# EAGLE design midimixer-channel (EAGLE 7.3.0)

## Sheet 1 of 2
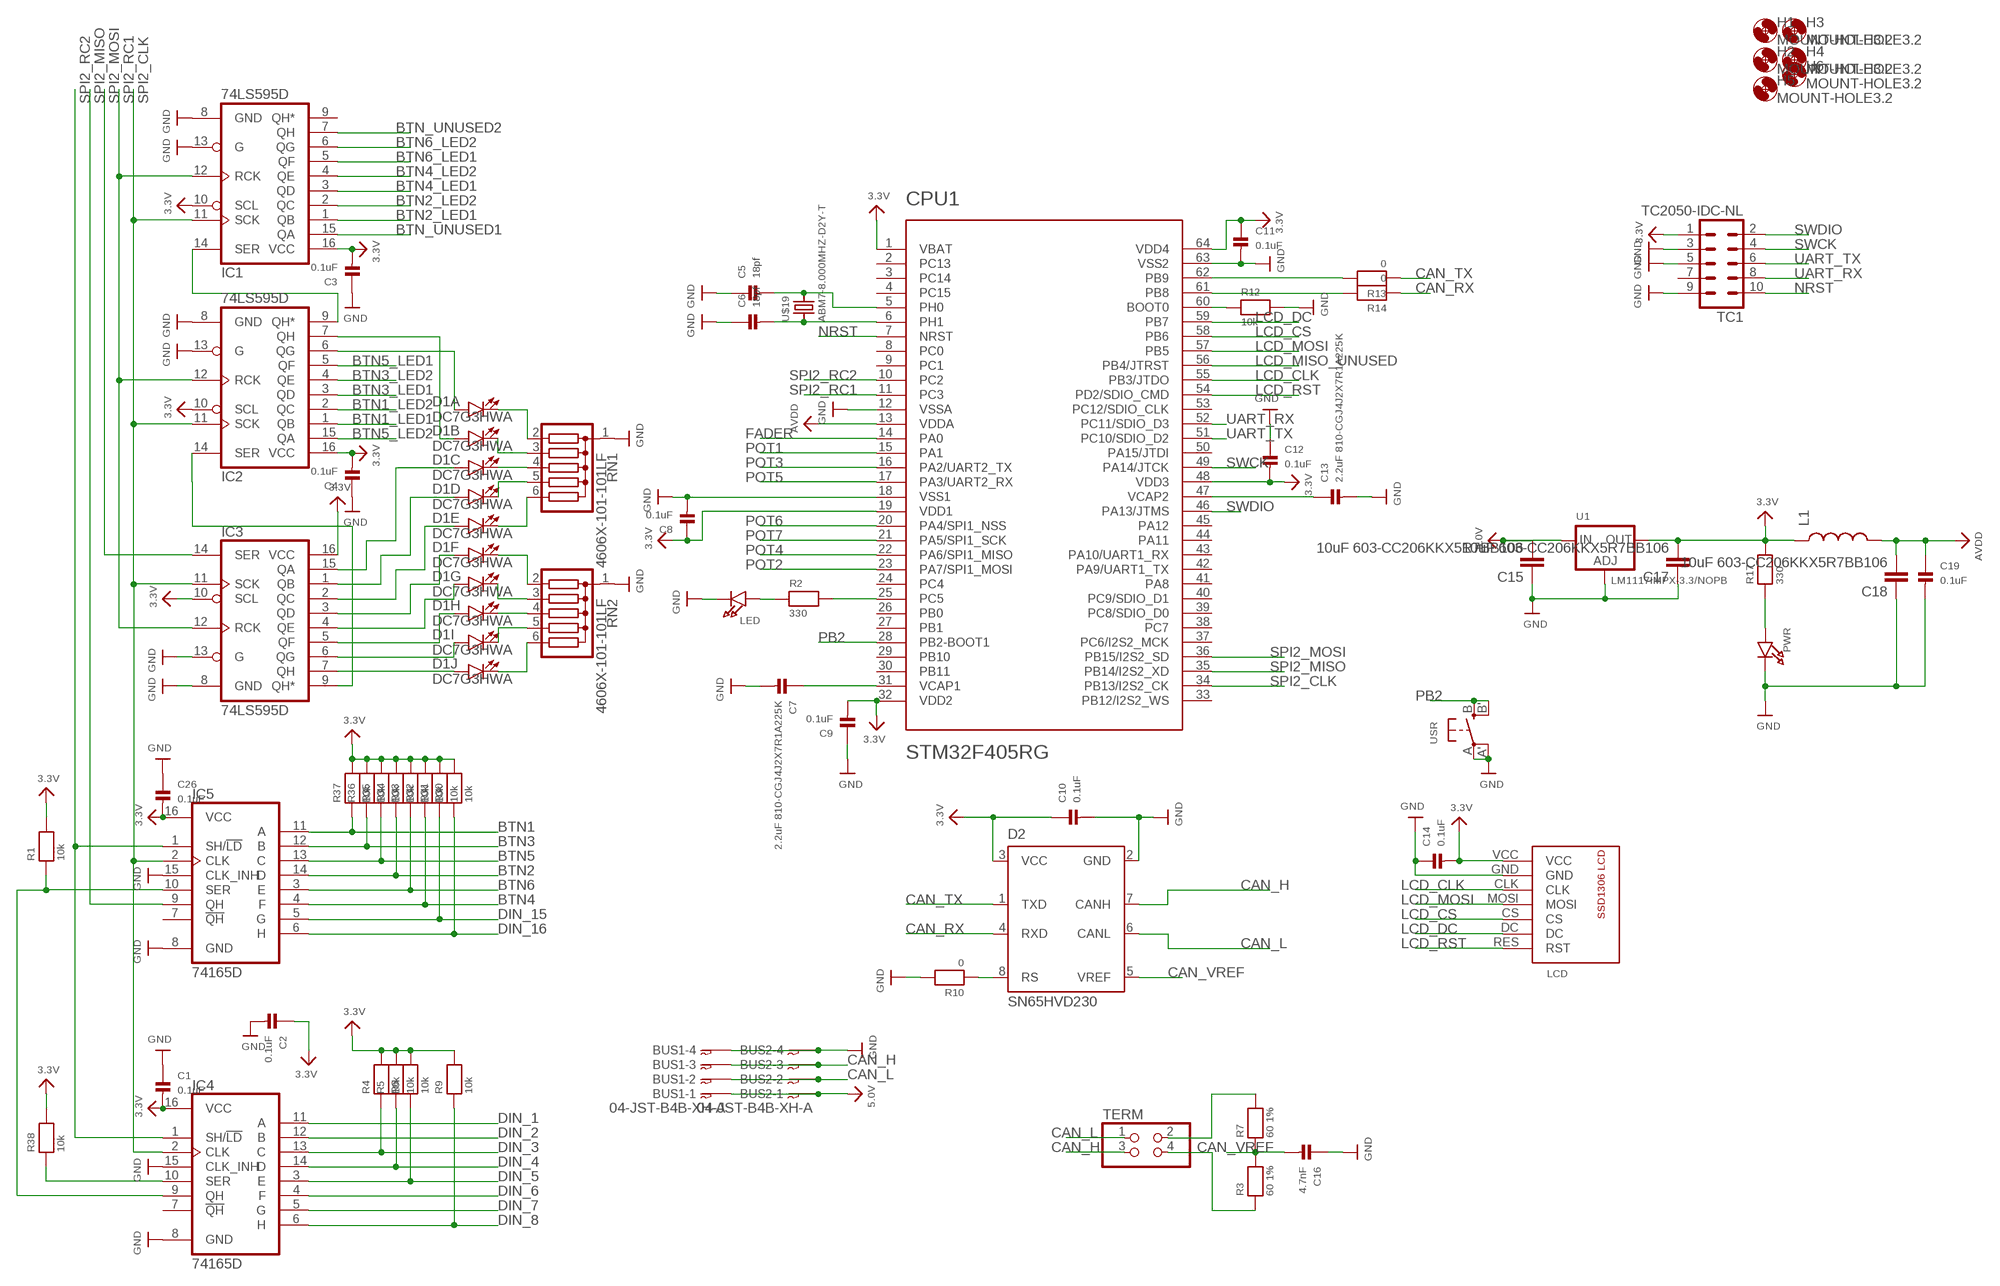
[diagram p0: schematic, sheet 1]

### Parts
BUS1  04-JST-B4B-XH-A  [B4B-XH]
BUS2  04-JST-B4B-XH-A  [B4B-XH]
C1  0.1uF  CAP_CERAMIC0603  [0603]
C2  0.1uF  CAP_CERAMIC0603  [0603]
C3  0.1uF  CAP_CERAMIC0603  [0603]
C4  0.1uF  CAP_CERAMIC0603  [0603]
C5  18pf  CAP_CERAMIC0603  [0603]
C6  18pf  CAP_CERAMIC0603  [0603]
C7  2.2uF 810-CGJ4J2X7R1A225K  CAP_CERAMIC0805  [0805]
C8  0.1uF  CAP_CERAMIC0603  [0603]
C9  0.1uF  CAP_CERAMIC0603  [0603]
C10  0.1uF  CAP_CERAMIC0603  [0603]
C11  0.1uF  CAP_CERAMIC0603  [0603]
C12  0.1uF  CAP_CERAMIC0603  [0603]
C13  2.2uF 810-CGJ4J2X7R1A225K  CAP_CERAMIC0805  [0805]
C14  0.1uF  CAP_CERAMIC0603  [0603]
C15  10uF 603-CC206KKX5R7BB106  CAP1206  [1206]
C16  4.7nF  CAP_CERAMIC0603  [0603]
C17  10uF 603-CC206KKX5R7BB106  CAP1206  [1206]
C18  10uF 603-CC206KKX5R7BB106  CAP1206  [1206]
C19  0.1uF  CAP_CERAMIC0603  [0603]
C26  0.1uF  CAP_CERAMIC0603  [0603]
CPU1  STM32F405RG  [TQFP64]
D1  DC7G3HWA  LED_BARGRAPH_10  [LED_BARGAPH_10]
D2  SN65HVD230  [SO8]
H1  MOUNT-HOLE3.2  [3,2]
H2  MOUNT-HOLE3.2  [3,2]
H3  MOUNT-HOLE3.2  [3,2]
H4  MOUNT-HOLE3.2  [3,2]
H5  MOUNT-HOLE3.2  [3,2]
H6  MOUNT-HOLE3.2  [3,2]
IC1  74LS595D  [SO16]
IC2  74LS595D  [SO16]
IC3  74LS595D  [SO16]
IC4  74165D  [SO16]
IC5  74165D  [SO16]
L1  INDUCTOR0805  [0805]
LCD  SSD1306-7PINWITHOUT-HOLES  [SSD1306-7PIN-NO-HOLES]
LED  LED0603  [CHIPLED_0603]
PWR  LED0603  [CHIPLED_0603]
R1  10k  RESISTOR_0603  [_0603]
R2  330  RESISTOR0603  [0603]
R3  60 1%  RESISTOR0603  [0603]
R4  10k  RESISTOR_0603  [_0603]
R5  10k  RESISTOR_0603  [_0603]
R6  10k  RESISTOR_0603  [_0603]
R7  60 1%  RESISTOR0603  [0603]
R9  10k  RESISTOR_0603  [_0603]
R10  0  RESISTOR_0603  [_0603]
R12  10k  RESISTOR_0603  [_0603]
R13  0  RESISTOR_0603  [_0603]
R14  0  RESISTOR_0603  [_0603]
R17  330  RESISTOR0603  [0603]
R30  10k  RESISTOR_0603  [_0603]
R31  10k  RESISTOR_0603  [_0603]
R32  10k  RESISTOR_0603  [_0603]
R33  10k  RESISTOR_0603  [_0603]
R34  10k  RESISTOR_0603  [_0603]
R35  10k  RESISTOR_0603  [_0603]
R36  10k  RESISTOR_0603  [_0603]
R37  10k  RESISTOR_0603  [_0603]
R38  10k  RESISTOR_0603  [_0603]
RN1  4606X-101-101LF  G05R  [SIL6]
RN2  4606X-101-101LF  G05R  [SIL6]
TC1  TC2050-IDC-NL  [TC2050-IDC-NL]
TERM  PINHD-2X2  [2X02]
U1  LM1117IMPX-3.3/NOPB  LM1117SOT223-REFLOW  [SOT223-R]
U$19  ABM7-8.000MHZ-D2Y-T  [ABM7-8.000MHZ-D2Y-T]
USR  SWITCH_TACT_SMT  [EVQ-Q2]

### Nets
3.3V: C1.2 C2.1 C3.2 C4.2 C8.1 C9.2 C10.1 C11.1 C12.2 C14.2 C17.2 C26.2 CPU1.1(VBAT) CPU1.19(VDD1) CPU1.32(VDD2) CPU1.48(VDD3) CPU1.64(VDD4) D2.3(VCC) IC1.10(SCL) IC1.16(VCC) IC2.10(SCL) IC2.16(VCC) IC3.10(SCL) IC3.16(VCC) IC4.16(VCC) IC5.16(VCC) L1.1 LCD.VCC R1.2 R4.2 R5.2 R6.2 R9.2 R17.2 R30.2 R31.2 R32.2 R33.2 R34.2 R35.2 R36.2 R37.2 R38.2 TC1.1 U1.2(OUT) ; also sheet 2
5.0V: BUS1.P$1 BUS2.P$1 C15.2 U1.3(IN)
AVDD: C18.2 C19.1 CPU1.13(VDDA) L1.2
BTN1: IC5.11(A) R37.1 ; also sheet 2
BTN1_LED1: IC2.1(QB) ; also sheet 2
BTN1_LED2: IC2.2(QC) ; also sheet 2
BTN2: IC5.14(D) R34.1 ; also sheet 2
BTN2_LED1: IC1.1(QB) ; also sheet 2
BTN2_LED2: IC1.2(QC) ; also sheet 2
BTN3: IC5.12(B) R36.1 ; also sheet 2
BTN3_LED1: IC2.3(QD) ; also sheet 2
BTN3_LED2: IC2.4(QE) ; also sheet 2
BTN4: IC5.4(F) R32.1 ; also sheet 2
BTN4_LED1: IC1.3(QD) ; also sheet 2
BTN4_LED2: IC1.4(QE) ; also sheet 2
BTN5: IC5.13(C) R35.1 ; also sheet 2
BTN5_LED1: IC2.5(QF) ; also sheet 2
BTN5_LED2: IC2.15(QA) ; also sheet 2
BTN6: IC5.3(E) R33.1 ; also sheet 2
BTN6_LED1: IC1.5(QF) ; also sheet 2
BTN6_LED2: IC1.6(QG) ; also sheet 2
BTN_UNUSED1: IC1.15(QA)
BTN_UNUSED2: IC1.7(QH)
CAN_H: BUS1.P$3 BUS2.P$3 D2.7(CANH) TERM.3
CAN_L: BUS1.P$2 BUS2.P$2 D2.6(CANL) TERM.1
CAN_RX: D2.4(RXD) R14.1
CAN_TX: D2.1(TXD) R13.1
CAN_VREF: C16.2 D2.5(VREF) R3.2 R7.1
DIN_1: IC4.11(A) ; also sheet 2
DIN_2: IC4.12(B) ; also sheet 2
DIN_3: IC4.13(C) R4.1 ; also sheet 2
DIN_4: IC4.14(D) R5.1
DIN_5: IC4.3(E) R6.1 ; also sheet 2
DIN_6: IC4.4(F) ; also sheet 2
DIN_7: IC4.5(G) ; also sheet 2
DIN_8: IC4.6(H) R9.1
DIN_15: IC5.5(G) R31.1
DIN_16: IC5.6(H) R30.1
FADER: CPU1.14(PA0) ; also sheet 2
GND: BUS1.P$4 BUS2.P$4 C1.1 C2.2 C3.1 C4.1 C5.1 C6.1 C7.2 C8.2 C9.1 C10.2 C11.2 C12.1 C13.2 C14.1 C15.1 C16.1 C17.1 C18.1 C19.2 C26.1 CPU1.12(VSSA) CPU1.18(VSS1) CPU1.63(VSS2) D2.2(GND) IC1.8(GND) IC1.13(G) IC2.8(GND) IC2.13(G) IC3.8(GND) IC3.13(G) IC4.8(GND) IC4.15(CLK_INH) IC5.8(GND) IC5.15(CLK_INH) LCD.GND LED.C PWR.C R10.2 R12.2 RN1.1 RN2.1 TC1.3 TC1.5 TC1.9 U1.1(ADJ) USR.A'(P1) USR.A(P) ; also sheet 2
LCD_CLK: CPU1.55(PB3/JTDO) LCD.CLK
LCD_CS: CPU1.58(PB6) LCD.CS
LCD_DC: CPU1.59(PB7) LCD.DC
LCD_MISO_UNUSED: CPU1.56(PB4/JTRST)
LCD_MOSI: CPU1.57(PB5) LCD.MOSI
LCD_RST: CPU1.54(PD2/SDIO_CMD) LCD.RES(RST)
N$1: C6.2 CPU1.6(PH1) U$19.P$1
N$2: C5.2 CPU1.5(PH0) U$19.P$2
N$3: C13.1 CPU1.47(VCAP2)
N$4: C7.1 CPU1.31(VCAP1)
N$5: PWR.A R17.1
N$6: CPU1.60(BOOT0) R12.1
N$7: D1.5(E:A) IC3.2(QC)
N$8: D1.2(B:A) IC2.7(QH)
N$11: D1.1(A:A) IC2.6(QG)
N$12: IC1.14(SER) IC2.9(QH*)
N$13: CPU1.62(PB9) R13.2
N$14: D1.20(A:C) RN1.2
N$15: D1.19(B:C) RN1.3
N$16: D1.18(C:C) RN1.4
N$17: D1.17(D:C) RN1.5
N$18: D1.16(E:C) RN1.6
N$19: D1.15(F:C) RN2.2
N$20: D1.14(G:C) RN2.3
N$21: D1.13(H:C) RN2.4
N$22: D1.12(I:C) RN2.5
N$23: D1.11(J:C) RN2.6
N$26: IC4.10(SER) R38.1
N$27: CPU1.61(PB8) R14.2
N$28: IC4.9(QH) IC5.10(SER) R1.1
N$31: LED.A R2.1
N$38: D1.10(J:A) IC3.7(QH)
N$41: D1.9(I:A) IC3.6(QG)
N$42: D1.8(H:A) IC3.5(QF)
N$43: CPU1.25(PC5) R2.2
N$46: R7.2 TERM.2
N$47: R3.1 TERM.4
N$52: D1.7(G:A) IC3.4(QE)
N$53: D1.6(F:A) IC3.3(QD)
N$55: D1.4(D:A) IC3.1(QB)
N$56: D1.3(C:A) IC3.15(QA)
N$57: IC2.14(SER) IC3.9(QH*)
N$73: D2.8(RS) R10.1
NRST: CPU1.7(NRST) TC1.10
PB2: CPU1.28(PB2-BOOT1) USR.B'(S1) USR.B(S)
POT1: CPU1.15(PA1) ; also sheet 2
POT2: CPU1.23(PA7/SPI1_MOSI) ; also sheet 2
POT3: CPU1.16(PA2/UART2_TX) ; also sheet 2
POT4: CPU1.22(PA6/SPI1_MISO) ; also sheet 2
POT5: CPU1.17(PA3/UART2_RX) ; also sheet 2
POT6: CPU1.20(PA4/SPI1_NSS) ; also sheet 2
POT7: CPU1.21(PA5/SPI1_SCK) ; also sheet 2
SPI2_CLK: CPU1.34(PB13/I2S2_CK) IC1.11(SCK) IC2.11(SCK) IC3.11(SCK) IC4.2(CLK) IC5.2(CLK)
SPI2_MISO: CPU1.35(PB14/I2S2_XD) IC5.9(QH)
SPI2_MOSI: CPU1.36(PB15/I2S2_SD) IC3.14(SER)
SPI2_RC1: CPU1.11(PC3) IC1.12(RCK) IC2.12(RCK) IC3.12(RCK)
SPI2_RC2: CPU1.10(PC2) IC4.1(SH/!LD) IC5.1(SH/!LD)
SWCK: CPU1.49(PA14/JTCK) TC1.4
SWDIO: CPU1.46(PA13/JTMS) TC1.2
UART_RX: CPU1.52(PC11/SDIO_D3) TC1.8
UART_TX: CPU1.51(PC10/SDIO_D2) TC1.6
Unconnected: CPU1.2(PC13) CPU1.3(PC14) CPU1.4(PC15) CPU1.8(PC0) CPU1.9(PC1) CPU1.24(PC4) CPU1.26(PB0) CPU1.27(PB1) CPU1.29(PB10) CPU1.30(PB11) CPU1.33(PB12/I2S2_WS) CPU1.37(PC6/I2S2_MCK) CPU1.38(PC7) CPU1.39(PC8/SDIO_D0) CPU1.40(PC9/SDIO_D1) CPU1.41(PA8) CPU1.42(PA9/UART1_TX) CPU1.43(PA10/UART1_RX) CPU1.44(PA11) CPU1.45(PA12) CPU1.50(PA15/JTDI) CPU1.53(PC12/SDIO_CLK) IC1.9(QH*) IC4.7(!QH) IC5.7(!QH) TC1.7

## Sheet 2 of 2
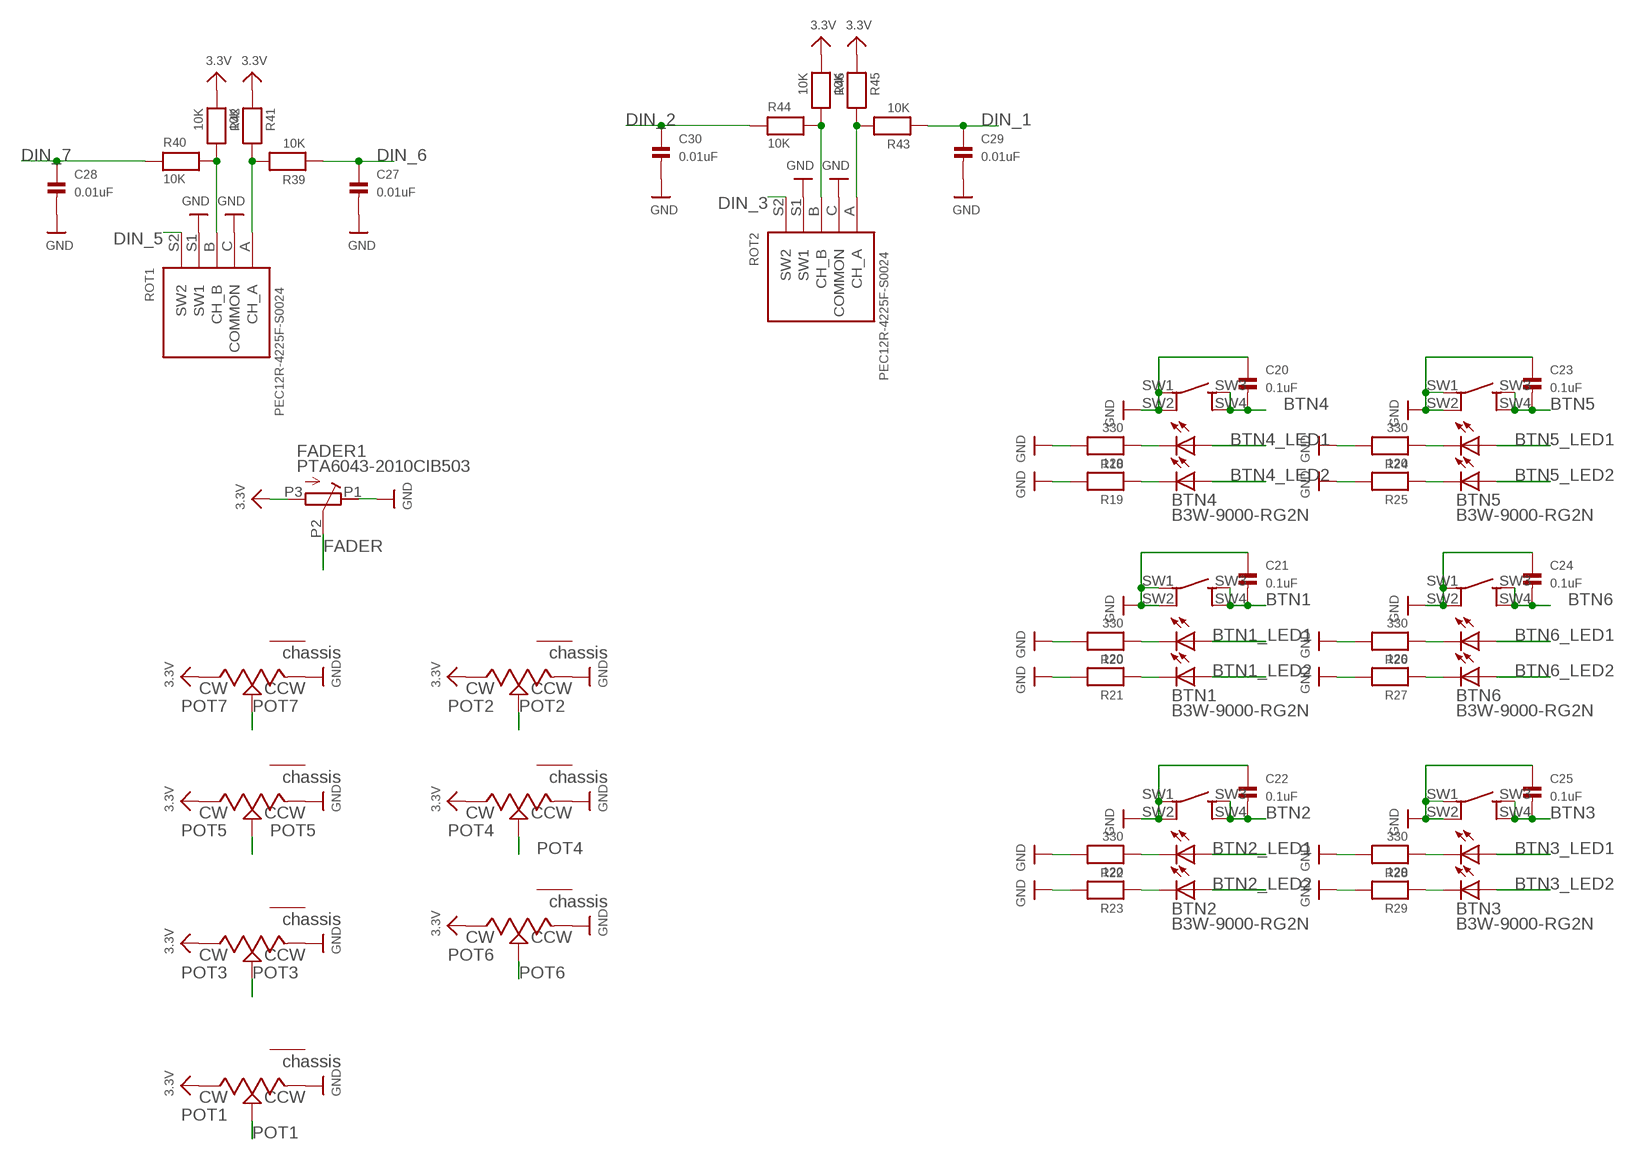
[diagram p1: schematic, sheet 2]

### Parts
BTN1  B3W-9000-RG2N  [B3W-9000-X2X]
BTN2  B3W-9000-RG2N  [B3W-9000-X2X]
BTN3  B3W-9000-RG2N  [B3W-9000-X2X]
BTN4  B3W-9000-RG2N  [B3W-9000-X2X]
BTN5  B3W-9000-RG2N  [B3W-9000-X2X]
BTN6  B3W-9000-RG2N  [B3W-9000-X2X]
C20  0.1uF  CAP_CERAMIC0603  [0603]
C21  0.1uF  CAP_CERAMIC0603  [0603]
C22  0.1uF  CAP_CERAMIC0603  [0603]
C23  0.1uF  CAP_CERAMIC0603  [0603]
C24  0.1uF  CAP_CERAMIC0603  [0603]
C25  0.1uF  CAP_CERAMIC0603  [0603]
C27  0.01uF  CAP_CERAMIC0603  [0603]
C28  0.01uF  CAP_CERAMIC0603  [0603]
C29  0.01uF  CAP_CERAMIC0603  [0603]
C30  0.01uF  CAP_CERAMIC0603  [0603]
FADER1  PTA6043-2010CIB503  PTA6043-2015CPB103  [PTA6043-2015CPB103]
POT1  POTENTIOMETERPTV09A_VERTICAL  [PTV09A-4]
POT2  POTENTIOMETERPTV09A_VERTICAL  [PTV09A-4]
POT3  POTENTIOMETERPTV09A_VERTICAL  [PTV09A-4]
POT4  POTENTIOMETERPTV09A_VERTICAL  [PTV09A-4]
POT5  POTENTIOMETERPTV09A_VERTICAL  [PTV09A-4]
POT6  POTENTIOMETERPTV09A_VERTICAL  [PTV09A-4]
POT7  POTENTIOMETERPTV09A_VERTICAL  [PTV09A-4]
R18  330  RESISTOR0603  [0603]
R19  120  RESISTOR0603  [0603]
R20  330  RESISTOR0603  [0603]
R21  120  RESISTOR0603  [0603]
R22  330  RESISTOR0603  [0603]
R23  120  RESISTOR0603  [0603]
R24  330  RESISTOR0603  [0603]
R25  120  RESISTOR0603  [0603]
R26  330  RESISTOR0603  [0603]
R27  120  RESISTOR0603  [0603]
R28  330  RESISTOR0603  [0603]
R29  120  RESISTOR0603  [0603]
R39  10K  RESISTOR0603  [0603]
R40  10K  RESISTOR0603  [0603]
R41  10K  RESISTOR0603  [0603]
R42  10K  RESISTOR0603  [0603]
R43  10K  RESISTOR0603  [0603]
R44  10K  RESISTOR0603  [0603]
R45  10K  RESISTOR0603  [0603]
R46  10K  RESISTOR0603  [0603]
ROT1  PEC12R-4225F-S0024  PEC11-4215K-S0024  [PEC111-4XXXK-SXXXX]
ROT2  PEC12R-4225F-S0024  PEC11-4215K-S0024  [PEC111-4XXXK-SXXXX]

### Nets
3.3V: FADER1.P3(E) POT1.CW POT2.CW POT3.CW POT4.CW POT5.CW POT6.CW POT7.CW R41.1 R42.1 R45.1 R46.1 ; also sheet 1
BTN1: BTN1.SW3(SW2_A) BTN1.SW4(SW2_B) C21.2 ; also sheet 1
BTN1_LED1: BTN1.LED1+ ; also sheet 1
BTN1_LED2: BTN1.LED2+ ; also sheet 1
BTN2: BTN2.SW3(SW2_A) BTN2.SW4(SW2_B) C22.2 ; also sheet 1
BTN2_LED1: BTN2.LED1+ ; also sheet 1
BTN2_LED2: BTN2.LED2+ ; also sheet 1
BTN3: BTN3.SW3(SW2_A) BTN3.SW4(SW2_B) C25.2 ; also sheet 1
BTN3_LED1: BTN3.LED1+ ; also sheet 1
BTN3_LED2: BTN3.LED2+ ; also sheet 1
BTN4: BTN4.SW3(SW2_A) BTN4.SW4(SW2_B) C20.2 ; also sheet 1
BTN4_LED1: BTN4.LED1+ ; also sheet 1
BTN4_LED2: BTN4.LED2+ ; also sheet 1
BTN5: BTN5.SW3(SW2_A) BTN5.SW4(SW2_B) C23.2 ; also sheet 1
BTN5_LED1: BTN5.LED1+ ; also sheet 1
BTN5_LED2: BTN5.LED2+ ; also sheet 1
BTN6: BTN6.SW3(SW2_A) BTN6.SW4(SW2_B) C24.2 ; also sheet 1
BTN6_LED1: BTN6.LED1+ ; also sheet 1
BTN6_LED2: BTN6.LED2+ ; also sheet 1
DIN_1: C29.1 R43.1 ; also sheet 1
DIN_2: C30.1 R44.1 ; also sheet 1
DIN_3: ROT2.S2(SW2) ; also sheet 1
DIN_5: ROT1.S2(SW2) ; also sheet 1
DIN_6: C27.1 R39.1 ; also sheet 1
DIN_7: C28.1 R40.1 ; also sheet 1
FADER: FADER1.P2(S) ; also sheet 1
GND: BTN1.SW1(SW1_A) BTN1.SW2(SW1_B) BTN2.SW1(SW1_A) BTN2.SW2(SW1_B) BTN3.SW1(SW1_A) BTN3.SW2(SW1_B) BTN4.SW1(SW1_A) BTN4.SW2(SW1_B) BTN5.SW1(SW1_A) BTN5.SW2(SW1_B) BTN6.SW1(SW1_A) BTN6.SW2(SW1_B) C20.1 C21.1 C22.1 C23.1 C24.1 C25.1 C27.2 C28.2 C29.2 C30.2 FADER1.P1(A) POT1.CCW POT2.CCW POT3.CCW POT4.CCW POT5.CCW POT6.CCW POT7.CCW R18.2 R19.2 R20.2 R21.2 R22.2 R23.2 R24.2 R25.2 R26.2 R27.2 R28.2 R29.2 ROT1.C(COMMON) ROT1.S1(SW1) ROT2.C(COMMON) ROT2.S1(SW1) ; also sheet 1
N$9: BTN4.LED1- R18.1
N$10: BTN4.LED2- R19.1
N$24: BTN1.LED1- R20.1
N$25: BTN1.LED2- R21.1
N$29: BTN5.LED1- R24.1
N$30: BTN5.LED2- R25.1
N$32: R40.2 R42.2 ROT1.B(CH_B)
N$33: R39.2 R41.2 ROT1.A(CH_A)
N$34: BTN6.LED1- R26.1
N$35: BTN6.LED2- R27.1
N$36: R44.2 R46.2 ROT2.B(CH_B)
N$37: R43.2 R45.2 ROT2.A(CH_A)
N$39: BTN2.LED1- R22.1
N$40: BTN2.LED2- R23.1
N$44: BTN3.LED1- R28.1
N$45: BTN3.LED2- R29.1
POT1: POT1.CENTER(WIPER) ; also sheet 1
POT2: POT2.CENTER(WIPER) ; also sheet 1
POT3: POT3.CENTER(WIPER) ; also sheet 1
POT4: POT4.CENTER(WIPER) ; also sheet 1
POT5: POT5.CENTER(WIPER) ; also sheet 1
POT6: POT6.CENTER(WIPER) ; also sheet 1
POT7: POT7.CENTER(WIPER) ; also sheet 1
Unconnected: POT1.4(CHASSIS) POT2.4(CHASSIS) POT3.4(CHASSIS) POT4.4(CHASSIS) POT5.4(CHASSIS) POT6.4(CHASSIS) POT7.4(CHASSIS)

## Library data of the parts
BTN1-BTN6 = keves:B3W-9000-RG2N
BUS1 BUS2 = bt_con-jst-xh:04-JST: JST CONNECTOR
C1-C14 C16 C19-C30 = microbuilder:CAP_CERAMIC: Ceramic Capacitors 0402 - 0402 Surface Mount Capacitors 16pF 50V 5% [Digikey: 445-4899-2-ND] 18pF 50V 5% [Digikey: 490-1281-2-ND] 22pF 50V 5% [Digikey: 490-1283-2-ND] 68pF 50V 5% [Digikey: 490-1289-2-ND] 0.1uF 10V 10% [Digikey: 490-1318-2-ND] 1.0uF 6.3V 10% [Digikey: 490-1320-2-ND] 0603 - 0603 Surface Mount Capacitors 16 pF 50V 5% [Digikey: 445-5051-2-ND] 22 pF 50V [Digikey: PCC220ACVTR-ND] 33 pF 50V 5% [Digikey: 490-1415-1-ND] 56pF 50V 5% [Digikey: 490-1421-1-ND] 220pF 50V 5% [Digikey: 445-1285-1-ND] 680 pF 50V 2200 pF 50V 5% C0G [Digikey: 445-1297-1-ND] 5600 pF 100V 5% X7R [Digikey: 478-3711-1-ND] 0.1 µF 25V 10% [Digikey: PCC2277TR-ND] 0.22 µF 16V 10% X7R [Digikey: 445-1318-1-ND] 1.0 µF 25V 10% [Digikey: 445-5146-2-ND] 0603 - RF Specific 3pF 250V +/-0.1pF RF [Digikey: 712-1347-1-ND] 18 pF 250V 5% [Digikey: 478-3505-1-ND or 712-1322-1-ND] 56 pF 250V 5% C0G RF [Digikey: 490-4867-1-ND] 68 pF 250V RF [Digikey: 490-4868-1-ND] 0805 - 0805 Surface Mount Capacitors 220 pF 250V 2% RF Ceramic Capacitor [Digikey: 712-1398-1-ND] 1000 pF 50V 2% NP0 Ceramic Capacitor [Digikey: 478-3760-1-ND] 0.1 µF 25V 10% Ceramic Capacitor [Digikey: PCC1828TR-ND] 1.0 µF 16V 10% Ceramic Capacitor[Digikey: 490-1691-2-ND] 10.0 µF 10V 10% Ceramic Capacitor[Digikey: 709-1228-1-ND] 10.0 uF 16V 10% Ceramic Capacitor [Digikey: 478-5165-2-ND] 47 uF 6.3V 20% Ceramic Capacitor [Digikey: 587-1779-1-ND or 399-5506-1-ND] 1206 - 1206 Surface Mount Capacitors 47uF 10V 20% Ceramic Capacitor [Digikey: 490-5528-1-ND or 399-5508-1-ND or 445-6010-1-ND] 100uF 6.3V -20%, +80% Y5V Ceramic Capacitor (Digikey: 490-4512-1-ND, Mouser: 81-GRM31CF50J107ZE1L)
C15 C17 C18 = SparkFun-Passives:CAP: Capacitor Standard 0603 ceramic capacitor, and 0.1" leaded capacitor.
CPU1 = SparkFun-DigitalIC:STM32F405RG: ARM DSP Chip used on the WAV Trigger board.
D1 = SparkFun-LED:LED_BARGRAPH_10: 10-Segment LED Bar Graph SFE part numbers: COM-09935 (red, Vf = 2.1V, Ifmax = 20mA) COM-09936 (yellow, Vf = 2.1V, Ifmax = 20mA) COM-09937 (blue, Vf = 3.4V, Ifmax = 20mA) COM-09938 (green, Vf = 3.4V, Ifmax = 20mA)
D2 = omc:SN65HVD230: SN65HVD230 - 3.3V CAN Transceiver - 3.3V operation - ISO 11898 compliant - up to 1Mbps - up to 120 nodes - listen only mode - slope control
FADER1 = keves:PTA6043-2015CPB103
H1-H6 = holes:MOUNT-HOLE: MOUNTING HOLE with drill center marker
IC1-IC3 = SparkFun-DigitalIC:74*595: 8-bit SHIFT REGISTER, output latch; PROD_ID: IC-07875
IC4 IC5 = SparkFun-DigitalIC:74*165
L1 = SparkFun-Passives:INDUCTOR: Inductors Basic Inductor/Choke - 0603 and 1206. Footprints are not proven and vary greatly between part numbers. INDUCTOR POWER 3.3UH 4.0A SMD 0.197" L x 0.197" W x 0.177" H (5.00mm x 5.00mm x 4.50mm)
LCD = keves:SSD1306-7PIN: https://www.aliexpress.com/item/free-shipping-0-96-inch-OLED-display-module-128X64-OLED-For-arduino-I2C-IIC-SPI-7p/32595065668.html?ws_ab_test=searchweb0_0,searchweb201602_1_116_117_10065_10068_114_10067_115_10069_113_10017_10080_10082_10081_10060_10061_10062_10056_10055_10054_10059_10078_10079_10073_10070_10052_10053_10050_10051,searchweb201603_6&btsid=51ed1bae-6cee-4f36-9ddd-1a85c2e0ff68
LED PWR = microbuilder:LED: LED 0603 - 0603 Surface Mount Package 2mA: Green LED - Low Power (3.9mcd, 2ma, 1.7Vf) - Digikey: 475-2709-2-ND Orange LED - Low Power (9.8mcd, 2ma, 1.8Vf) - Digikey: 475-1194-2-ND Red LED - Low Power (5mcd, 2ma, 1.8Vf) - Digikey: 475-1195-2-ND Yellow LED - Low Power (7mcd, 2ma, 1.8Vf) - Digikey: 475-1196-2-ND 5mA: Blue LED - Low Power (17mcd, 5ma, 2.9Vf) - Digikey: LNJ937W8CRACT-ND 0805 - 0805 Surface Mount Package 2mA: Red LED (8.8mcd, 2mA, 1.8Vf, Clear) - Low Power [Digikey: 475-2510-1-ND] Green LED (5mcd, 2mA, 1.8Vf, Clear) - Low Power [Digikey: 475-2730-1-ND] Yellow LED (11.3mcd, 2mA, 1.8Vf, Clear) - Low Power [Digikey: 475-2555-1-ND] 20mA: Red LED (104mcd, 20mA, Diffused) - LS R976 [Digikey: 475-1278-6-ND] Red LED (12mcd, 20mA, 2.0Vf, Clear) - APT2012EC [Digikey: 754-1128-1-ND] Green LED (15mcd, 20mA, 2.2Vf, Clear) - APT2012GC [Digikey: 754-1131-1-ND] Orange LED (160mcd, 20mA, 2.1Vf, Clear) - APT2012SECK [Digikey: 754-1130-1-ND] 1206 - 1206 Surface Mount Package Green LED (26mcd, 20mA, Diffused) - LG N971 [Digikey: 475-1407-6-ND] Red LED (15mcd, 20mA, Diffused) - LH N974 [Digikey: 475-1416-6-ND]
POT1-POT7 = keves:POTENTIOMETER
R1-R7 R9 R10 R12-R14 R17-R46 = microbuilder:RESISTOR: Resistors 0402 - 0402 Surface Mount Package 22 Ohm 1% 1/16W [Digikey: 311-22.0LRTR-ND] 33 Ohm 5% 1/16W 1.0K 5% 1/16W 1.5K 5% 1/16W 2.0K 1% 1/16W 10.0K 1% 1/16W [Digikey: 311-10.0KLRTR-ND] 10.0K 5% 1/16W [Digikey: RMCF0402JT10K0TR-ND] 12.1K 1% 1/16W [Digikey: 311-22.0LRTR-ND] 100.0K 5% 1/16W 0603 - 0603 Surface Mount Package 0 Ohm 1/10 Watt 1% Resistor 15 Ohm 1/10 Watt 1% Resistor 33 Ohm 1/10 Watt 1% Resistor 49.9 Ohm 1/10 Watt 1% Resistor 100 Ohm 1/10 Watt 1% Resistor 150 Ohm 1/10 Watt 1% Resistor 240 Ohm 1/10 Watt 1% Resistor 390 Ohm 1/10 Watt 1% Resistor 560 Ohm 1/10 Watt 1% Resistor 680 Ohm 1/10 Watt 1% Resistor 750 Ohm 1/10 Watt 1% Resistor 1.0K Ohm 1/10 Watt 1% Resistor 1.5K Ohm 1/10 Watt 1% Resistor 2.0K Ohm 1/10 Watt 1% Resistor 2.2K Ohm 1/10 Watt 1% Resistor 3.3K Ohm 1/10 Watt 1% Resistor 4.7K Ohm 1/10 Watt 1% Resistor 10.0K Ohm 1/10 Watt 1% Resistor 12.0K Ohm 1/10 Watt 1% Resistor 12.1K Ohm 1/10 Watt 1% Resistor 20.0K Ohm 1/10 Watt 1% Resistor 33.0K Ohm 1/10 Watt 1% Resistor 100.0K Ohm 1/10 Watt 1% Resistor 0805 - 0805 Surface Mount Package 0 Ohm 1/8 Watt 1% Resistor 33 Ohm 1/8 Watt 1% Resistor 100 Ohm 1/8 Watt 1% Resistor 150 Ohm 1/8 Watt 1% Resistor 200 Ohm 1/8 Watt 1% Resistor 240 Ohm 1/8 Watt 1% Resistor 330 Ohm 1/8 Watt 1% Resistor 390 Ohm 1/8 Watt 1% Resistor 470 Ohm 1/8 Watt 1% Resistor 1.0K Ohm 1/8 Watt 1% Resistor 1.5K Ohm 1/8 Watt 1% Resistor 2.0K Ohm 1/8 Watt 1% Resistor 4.7K Ohm 1/8 Watt 1% Resistor 5.1K Ohm 1/8 Watt 1% Resistor 5.6K Ohm 1/8 Watt 1% Resistor 10.0K Ohm 1/8 Watt 1% Resistor 22.0K Ohm 1/8 Watt 1% Resistor 33.0K Ohm 1/8 Watt 1% Resistor 100K Ohm 1/8 Watt 1% Resistor 1206 - 1206 Surface Mount Package 2012 - 2010 Surface Mount Package 0.11 Ohm 1/2 Watt 1% Resistor - Digikey: RHM.11UCT-ND
RN1 RN2 = resistor-sil:G05R: SIL RESISTOR; OC_FARNELL: unknown; OC_NEWARK: unknown
ROT1 ROT2 = keves:PEC11-4215K-S0024
TC1 = TagConnect:TC2050-IDC: Tag-Connect In Circuit Programming & Debug Cable 10 Pin http://www.tag-connect.com
TERM = pinhead:PINHD-2X2: PIN HEADER
U1 = microbuilder:LM1117: LM1117 Voltage Regulator LM1117 Adjustable Voltage regulator [Digikey: LM1117IMP-ADJDKR-ND] LM1117 3.3V Voltage regulator [AP1117E33GDIDKR-ND] LM1117 5.0V Voltage regulator [AP1117E50GDIDKR-ND] SOT223-REFLOW - SOT223 package for solder paste/reflow ovens SOT223-WAVE - SOT223 package for hand-soldering (larger pads) Note: For the fixed-voltage regulators, simply set the ADJ pin to GND.
U$19 = keves:ABM7-8.000MHZ-D2Y-T
USR = microbuilder:SWITCH_TACT_SMT: SMT Tact Switches 6x6mm - Digikey: P12940SCT-ND KMR2 (4.6x2.8mm) - Digikey: 401-1426-1-ND EVQ-PQHB55 - Light Touch, 160GF (4.5x4.5mm) - Digikey: P8090SCT-ND

## Board
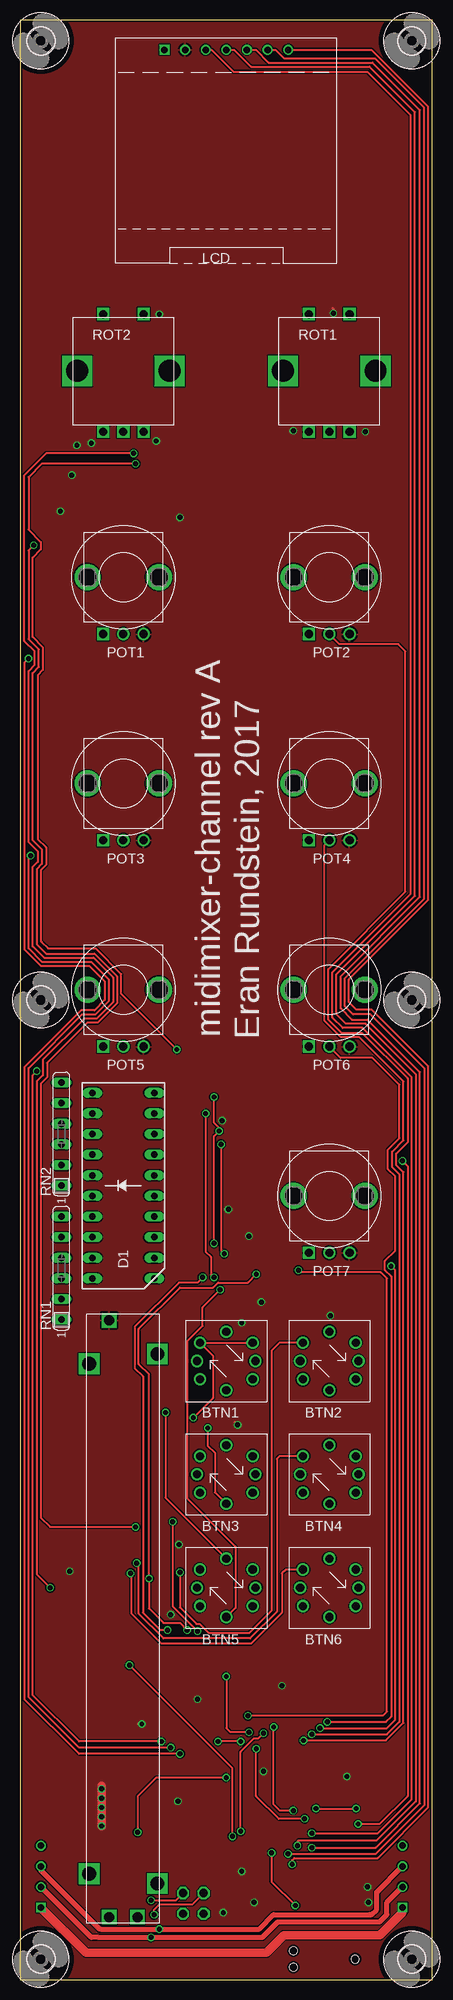
[diagram p2: board, top side]
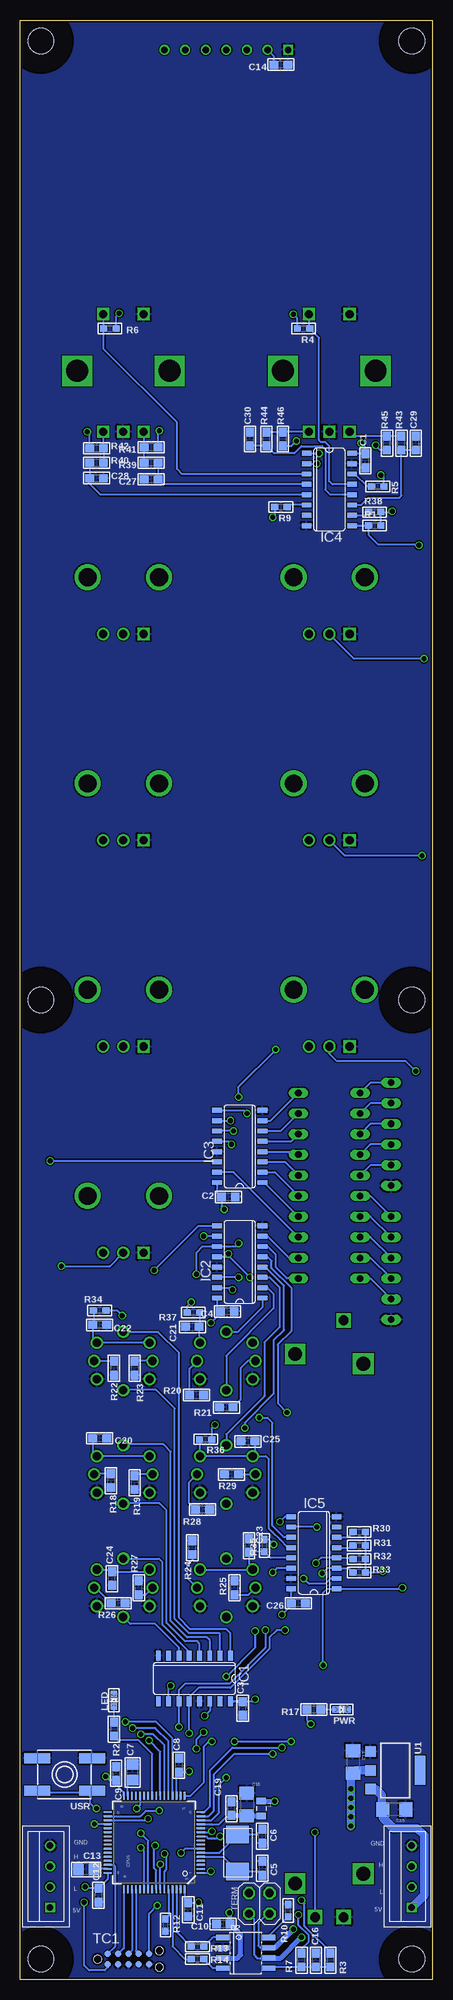
[diagram p3: board, bottom side, seen from below]

Size 50.8 x 241.3 mm. Coordinates in mm from the lower left corner, seen from the top.
Outline: 0,0 50.8,0 50.8,241.3 0,241.3 0,0
Copper layers (1*16): Top 0.035mm / dielectric 1.5mm / Bottom 0.035mm
Design rules "MacroFab_Standard_2_Layer *": minimum track width 6mil, minimum drill 12mil, track to track 6mil, track to pad 6mil, pad to pad 6mil, via to via 6mil, smd to smd 0mil, copper to edge 10mil, drill to drill 10mil, minimum pad ring 6mil, minimum via ring 6mil, stop-mask expansion 2mil, vias tented up to drill 25mil, thermal gap 10mil

### Footprints (pad centres in the part's own frame; a part is rotated, then mirrored left to right if it is on the bottom)
B3W-9000-X2X = drill 1: LED1+ 0,3.6; LED1- 3.6,0; LED2+ 0,-3.6; LED2- -3.6,0; SW1 3.25,-2.25; SW2 -3.25,-2.25; SW3 3.25,2.25; SW4 -3.25,2.25
B4B-XH = drill 0.8 square: P$1 -3.81,0 | drill 0.8: P$2 -1.27,0; P$3 1.27,0; P$4 3.81,0
0603 = smd 1.1 x 1: 1 -0.85,0; 2 0.85,0
0805 = smd 1.3 x 1.5: 1 -0.95,0; 2 0.95,0
1206 = smd 1.6 x 1.8: 1 -1.4,0; 2 1.4,0
TQFP64 = smd 0.22 x 1: 1 -3.75,-5.75; 2 -3.25,-5.75; 3 -2.75,-5.75; 4 -2.25,-5.75; 5 -1.75,-5.75; 6 -1.25,-5.75; 7 -0.75,-5.75; 8 -0.25,-5.75; 9 0.25,-5.75; 10 0.75,-5.75; 11 1.25,-5.75; 12 1.75,-5.75; 13 2.25,-5.75; 14 2.75,-5.75; 15 3.25,-5.75; 16 3.75,-5.75; 33 3.75,5.75; 34 3.25,5.75; 35 2.75,5.75; 36 2.25,5.75; 37 1.75,5.75; 38 1.25,5.75; 39 0.75,5.75; 40 0.25,5.75; 41 -0.25,5.75; 42 -0.75,5.75; 43 -1.25,5.75; 44 -1.75,5.75; 45 -2.25,5.75; 46 -2.75,5.75; 47 -3.25,5.75; 48 -3.75,5.75 | smd 1 x 0.22: 17 5.75,-3.75; 18 5.75,-3.25; 19 5.75,-2.75; 20 5.75,-2.25; 21 5.75,-1.75; 22 5.75,-1.25; 23 5.75,-0.75; 24 5.75,-0.25; 25 5.75,0.25; 26 5.75,0.75; 27 5.75,1.25; 28 5.75,1.75; 29 5.75,2.25; 30 5.75,2.75; 31 5.75,3.25; 32 5.75,3.75; 49 -5.75,3.75; 50 -5.75,3.25; 51 -5.75,2.75; 52 -5.75,2.25; 53 -5.75,1.75; 54 -5.75,1.25; 55 -5.75,0.75; 56 -5.75,0.25; 57 -5.75,-0.25; 58 -5.75,-0.75; 59 -5.75,-1.25; 60 -5.75,-1.75; 61 -5.75,-2.25; 62 -5.75,-2.75; 63 -5.75,-3.25; 64 -5.75,-3.75
LED_BARGAPH_10 = drill 0.813 long: 1 -11.43,-3.81; 2 -8.89,-3.81; 3 -6.35,-3.81; 4 -3.81,-3.81; 5 -1.27,-3.81; 6 1.27,-3.81; 7 3.81,-3.81; 8 6.35,-3.81; 9 8.89,-3.81; 10 11.43,-3.81; 11 11.43,3.81; 12 8.89,3.81; 13 6.35,3.81; 14 3.81,3.81; 15 1.27,3.81; 16 -1.27,3.81; 17 -3.81,3.81; 18 -6.35,3.81; 19 -8.89,3.81; 20 -11.43,3.81
SO8 = smd 0.65 x 1.75: 1 -1.905,-2.8; 2 -0.635,-2.8; 3 0.635,-2.8; 4 1.905,-2.8; 5 1.905,2.8; 6 0.635,2.8; 7 -0.635,2.8; 8 -1.905,2.8
PTA6043-2015CPB103 = drill 1.2 square: P1 -36.75,1.75; P2 -36.75,-1.75; P3 36.75,1.75 | drill 1.7 square: P$1 -31.4,4.2; P$2 31.4,4.2; P$3 -32.6,-4.2; P$4 32.6,-4.2
3,2 = hole 3.2: 0,0
SO16 = smd 0.6 x 1.2: 1 -4.445,-2.8; 2 -3.175,-2.8; 3 -1.905,-2.8; 4 -0.635,-2.8; 5 0.635,-2.8; 6 1.905,-2.8; 7 3.175,-2.8; 8 4.445,-2.8; 9 4.445,2.8; 10 3.175,2.8; 11 1.905,2.8; 12 0.635,2.8; 13 -0.635,2.8; 14 -1.905,2.8; 15 -3.175,2.8; 16 -4.445,2.8
0805' = smd 0.8 x 1.2: 1 -0.9,0; 2 0.9,0
SSD1306-7PIN-NO-HOLES = drill 0.8: CLK -2.54,24.3; CS 7.62,24.3; DC 5.08,24.3; MOSI 0,24.3; RES 2.54,24.3; VCC -5.08,24.3 | drill 0.8 square: GND -7.62,24.3
CHIPLED_0603 = smd 0.8 x 0.8: A 0,-0.75; C 0,0.75
PTV09A-4 = drill 2.2: 4 -4.4,0; 5 4.4,0 | drill 1 square: CCW -2.5,-7 | drill 1: CENTER 0,-7; CW 2.5,-7
_0603 = smd 0.9 x 0.8: 1 -0.762,0; 2 0.762,0
SIL6 = drill 0.813 long: 1 -6.35,0; 2 -3.81,0; 3 -1.27,0; 4 1.27,0; 5 3.81,0; 6 6.35,0
PEC111-4XXXK-SXXXX = drill 1 square: A -2.5,-7.5; B 2.5,-7.5; C 0,-7.5; S1 -2.5,7; S2 2.5,7 | drill 2.7 square: P$1 -5.7,0; P$2 5.7,0
TC2050-IDC-NL = smd 0.787 x 0.787: 1 -2.54,-0.635; 2 -2.54,0.635; 3 -1.27,-0.635; 4 -1.27,0.635; 5 0,-0.635; 6 0,0.635; 7 1.27,-0.635; 8 1.27,0.635; 9 2.54,-0.635; 10 2.54,0.635 | hole 0.991: -3.81,0; 3.81,1.016; 3.81,-1.016
2X02 = drill 1.016 octagon: 1 -1.27,-1.27; 2 -1.27,1.27; 3 1.27,-1.27; 4 1.27,1.27
SOT223-R = smd 1.3 x 1.3: 1 -2.3,-3.05; 2 0,-3.05; 3 2.3,-3.05 | smd 3.6 x 1.3: 4 0,3.05
ABM7-8.000MHZ-D2Y-T = smd 2.159 x 2.845: P$1 -2.273,0; P$2 2.273,0
EVQ-Q2 = smd 3.2 x 1.2: A -3.4,-2; A' 3.4,-2; B -3.4,2; B' 3.4,2

### Placement (x,y rotation side)
BTN1  25.4,76.2 0 top
BTN2  38.1,76.2 0 top
BTN3  25.4,62.23 0 top
BTN4  38.1,62.23 0 top
BTN5  25.4,48.26 0 top
BTN6  38.1,48.26 0 top
BUS1  2.54,12.7 90 bottom
BUS2  47.12,12.7 90 bottom
C1  8.26,187.07 90 bottom
C2  25.15,96.39 0 bottom
C3  23.37,33.4 90 bottom
C4  25.27,82.3 180 bottom
C5  20.95,13.72 270 bottom
C6  20.95,17.65 90 bottom
C7  36.96,25.53 90 bottom
C8  31.24,26.42 90 bottom
C9  38.99,25.4 270 bottom
C10  25.78,6.86 180 bottom
C11  30.1,8.64 270 bottom
C12  41.15,10.41 90 bottom
C13  42.67,13.59 180 bottom
C14  18.67,235.84 180 bottom
C15  4.7,20.95 180 bottom
C16  14.35,2.41 270 bottom
C17  9.78,26.8 270 bottom
C18  22.86,21.59 270 bottom
C19  24.77,21.08 90 bottom
C20  41.02,66.67 180 bottom
C21  29.59,80.39 0 bottom
C22  41.02,80.64 180 bottom
C23  22.61,53.47 270 bottom
C24  39.5,49.4 90 bottom
C25  22.73,66.29 0 bottom
C26  16.51,46.35 180 bottom
C27  34.67,184.78 180 bottom
C28  41.4,184.91 0 bottom
C29  2.03,189.23 90 bottom
C30  22.48,189.74 90 bottom
CPU1  34.29,16.89 90 bottom
D1  12.7,97.79 90 top
D2  22.99,3.3 270 bottom
FADER1  12.7,44.45 90 top
H1  48.26,2.54 0 top
H2  2.54,238.76 0 top
H3  2.54,2.54 0 top
H4  48.26,238.76 0 top
H5  2.54,120.65 0 top
H6  48.26,120.65 0 top
IC1  29.34,37.08 180 bottom
IC2  23.75,88.39 90 bottom
IC3  23.75,102.62 90 bottom
IC4  12.7,183.51 270 bottom
IC5  14.61,52.58 90 bottom
L1  [0805']  21.08,21.08 270 bottom
LCD  25.4,213.36 0 top
LED  39.24,34.42 0 bottom
POT1  12.7,172.72 0 top
POT2  38.1,172.72 0 top
POT3  12.7,147.32 0 top
POT4  38.1,147.32 0 top
POT5  12.7,121.92 0 top
POT6  38.1,121.92 0 top
POT7  38.1,96.52 0 top
PWR  11.18,33.27 270 bottom
R1  7.11,179.07 0 bottom
R2  39.24,30.86 270 bottom
R3  12.57,2.41 270 bottom
R4  15.88,203.33 180 bottom
R5  6.73,183.9 0 bottom
R6  39.75,203.33 0 bottom
R7  16.13,2.41 90 bottom
R9  18.67,181.36 180 bottom
R10  17.78,8.51 90 bottom
R12  32.89,6.73 270 bottom
R13  28.96,4.06 180 bottom
R14  28.96,2.54 180 bottom
R17  14.61,33.27 180 bottom
R18  39.62,61.47 270 bottom
R19  36.7,61.21 270 bottom
R20  29.08,72.01 0 bottom
R21  25.4,70.48 180 bottom
R22  39.24,75.31 270 bottom
R23  36.7,75.31 270 bottom
R24  29.59,53.21 90 bottom
R25  24.38,48.26 90 bottom
R26  38.73,46.35 0 bottom
R27  36.2,48.26 90 bottom
R28  28.32,57.91 0 bottom
R29  24.77,62.23 180 bottom
R30  9.02,55.12 0 bottom
R31  9.02,53.47 0 bottom
R32  9.02,51.82 0 bottom
R33  9.02,50.16 0 bottom
R34  41.02,82.42 0 bottom
R35  20.7,53.47 90 bottom
R36  27.94,66.55 0 bottom
R37  29.46,82.17 180 bottom
R38  7.11,180.72 0 bottom
R39  34.67,186.82 180 bottom
R40  41.4,186.82 0 bottom
R41  34.67,188.72 180 bottom
R42  41.4,188.59 0 bottom
R43  3.81,189.23 90 bottom
R44  20.45,189.74 90 bottom
R45  5.59,189.23 90 bottom
R46  18.41,189.74 90 bottom
RN1  5.08,87.63 90 top
RN2  5.08,104.14 90 top
ROT1  38.1,198.12 0 top
ROT2  12.7,198.12 0 top
TC1  37.47,2.54 0 bottom
TERM  21.34,9.4 0 bottom
U1  4.57,25.78 270 bottom
U$19  24,15.62 270 bottom
USR  45.34,25.27 180 bottom

### Tracks (layer width: path | path; a pad name or v marks a point on that pad's centre or on a via)
3.3V  (via drill 0.6)
  Top 0.254: v42.93,9.53 42.93,9.65 | v27.3,13.34 27.18,13.34 27.05,13.46 | v28.83,9.53 28.45,9.53 | v27.3,80.9 27.56,80.9 | v25.65,94.87 25.4,94.87 | v24.89,105.79 24.77,105.79 | v18.54,44.96 18.8,44.7 | v38.23,81.79 37.85,81.79 | v26.8,68.33 26.42,68.71 | v29.72,83.44 29.34,83.44 | v21.84,34.54 21.59,34.8 | v32.26,36.2 32.13,36.32 | v14.99,31.5 14.48,31.5 | v42.55,190.63 42.67,190.75 | v33.66,190.75 33.53,190.75 33.4,190.88 | v38.61,205.23 38.61,205.74 38.48,205.87 | v17.14,205.1 17.14,205.23 | v19.68,180.09 19.94,179.83 | v6.99,188.98 6.99,189.1 | v6.35,185.29 6.48,185.42 | v4.95,180.85 4.7,181.1 | v8.76,189.23 9.14,189.23 | v40.26,25.02 40.39,25.15 | v6.1,50.29 5.97,50.42
  Top 1.016: v10.03,18.92 v10.03,20.07 v10.03,21.21 v10.03,22.35 v10.03,23.5 10.03,23.88
  Bottom 0.254: CPU1.1 27.5,13.14 v27.3,13.34 | CPU1.64 30.54,9.93 C11.1 28.87,9.49 v28.83,9.53 | IC2.16 26.55,82.72 C4.2 26.12,82.08 v27.3,80.9 | IC3.16 26.55,96.95 C2.1 26,95.21 v25.65,94.87 | IC3.10 v24.89,105.79 | IC2.10 v28.19,91.57 | R30.2 R31.2 R32.2 R33.2 6.22,50.16 v6.1,50.29 | IC5.16 17.41,46.4 C26.2 17.36,46.14 v18.54,44.96 | R35.2 20.19,54.23 v19.56,53.59 | R34.2 38.86,82.42 v38.23,81.79 | R36.2 27.18,67.94 v26.8,68.33 | R37.2 30.23,82.93 v29.72,83.44 | v21.84,34.54 22.1,34.28 IC1.16 24.85,34.33 23.45,34.33 C3.2 | IC1.10 32.51,35.94 v32.26,36.2 | R17.2 15.46,31.96 v14.99,31.5 | R42.1 42.25,190.33 v42.55,190.63 | R41.1 33.82,190.59 v33.66,190.75 | R6.2 38.99,204.85 v38.61,205.23 | R4.2 16.64,204.6 v17.14,205.1 | R9.2 19.43,180.34 v19.68,180.09 | IC4.16 8.29,187.96 | 8.29,187.96 C1.2 | R45.1 6.39,188.38 v6.99,188.98 | R1.2 R38.2 5.08,180.72 v4.95,180.85 | R5.2 5.97,184.91 v6.35,185.29 | R46.1 17.36,188.89 v16.76,189.48 | 8.29,187.96 8.29,188.76 v8.76,189.23 | CPU1.19 31.54,25.27 C8.1 30.06,25.57 v29.97,25.65 | v40.26,25.02 39.79,24.55 C9.2 38.99,24 38.04,23.05 CPU1.32 | C14.2 19.52,236.86 LCD.VCC | TC1.1 40.01,1.52 40.39,1.14 42.29,1.14 42.93,1.78 v42.93,9.53 | CPU1.48 40.04,12.37 C12.2 42.63,11.26 v42.8,11.43
  Bottom 0.61: 23.62,5.37 23.62,5.55 C10.1 25.02,6.95 v25.02,8.26
  Bottom 0.635: D2.3 24,2.67 23.62,3.05 23.62,5.37 | L1.1 19.44,21.98 v19.43,21.97
  Bottom 1.016: v10.03,18.92 v10.03,20.07 v10.03,21.21 v10.03,22.35 v10.03,23.5 10.03,25.14 C17.2 9.39,25.78 U1.2
  pour Top: -9.4,243.46 -9.02,-1.4 50.29,-1.52 56.77,8.13 56.52,242.82
5.0V
  Top 1.016: BUS2.P$1 47.12,8.26 44.32,5.46 32.51,5.46 30.35,3.3 8.13,3.3 BUS1.P$1
  Bottom 1.016: U1.3 6.97,23.48 6.22,22.73 6.22,21.08 C15.2 6.1,19.94 4.83,18.67 1.91,18.67 1.02,17.78 1.02,10.41 BUS1.P$1
AVDD
  Bottom 0.254: 24.97,20.03 C19.1 24.93,20.07 25.4,20.07 26.32,19.14 CPU1.13
  Bottom 0.635: C19.1 22.9,20.23 C18.2 L1.2
BTN1  (via drill 0.6)
  Top 0.254: v21.34,69.22 23.75,71.63 23.75,76.85 BTN1.SW4 BTN1.SW3
  Bottom 0.254: v21.34,69.22 20.32,69.22 19.68,68.58 19.68,55.88 18.29,54.48 IC5.11 | BTN1.SW3 28.74,78.54 C21.2 28.7,80.43 R37.1
BTN1_LED1
  Bottom 0.254: IC2.1 20.95,82.81 24,79.76 25.36,79.76 BTN1.LED1+
BTN1_LED2
  Bottom 0.254: IC2.2 20.32,85.22 19.56,84.45 19.56,82.68 25.4,76.83 BTN1.LED2+
BTN2  (via drill 0.6)
  Top 0.254: BTN2.SW4 31.97,78.45 30.99,77.47 30.99,45.47 28.19,42.67 23.24,42.67 22.1,43.81 21.72,43.81 19.68,45.85 v19.68,50.16
  Bottom 0.254: IC5.14 19.18,50.67 v19.68,50.16 | BTN2.SW4 BTN2.SW3 41.87,78.97 C22.2 41.78,80.73 R34.1
BTN2_LED1
  Bottom 0.254: IC1.1 24.89,42.67 25.4,43.18 29.84,43.18 31.24,44.58 31.24,77.22 33.78,79.76 38.06,79.76 BTN2.LED1+
BTN2_LED2
  Bottom 0.254: IC1.2 26.16,42.55 26.29,42.67 29.97,42.67 31.75,44.45 31.75,70.36 34.04,72.64 38.06,72.64 BTN2.LED2+
BTN3
  Bottom 0.254: IC5.12 17.78,53.21 18.8,54.23 19.68,55.12 20.19,55.63 20.19,64.14 20.54,64.48 BTN3.SW4 | 21.99,64.64 BTN3.SW4 | BTN3.SW4 BTN3.SW3 28.7,64.53 R36.1 | C25.2 21.88,64.75 BTN3.SW4
BTN3_LED1
  Bottom 0.254: BTN3.LED1+ 25.4,67.18 20.7,71.88 20.7,78.49 18.8,80.39 18.8,85.22 20.07,86.49 IC2.3
BTN3_LED2  (via drill 0.6)
  Top 0.254: v23.11,67.94 23.11,65.79 24,64.9 24,60.03 BTN3.LED2+
  Bottom 0.254: v23.11,67.94 23.11,68.58 19.56,72.14 19.56,78.74 18.29,80.01 18.29,85.47 20.45,87.63 20.82,87.63 IC2.4
BTN4  (via drill 0.6)
  Top 0.254: BTN4.SW4 31.97,64.48 31.62,64.14 31.62,45.34 28.32,42.04 17.65,42.04 14.61,45.09 14.61,51.05 v14.35,51.31
  Bottom 0.254: v14.35,51.31 13.72,51.94 IC5.4 9.91,51.94 R32.1 | BTN4.SW4 BTN4.SW3 41.87,65 C20.2
BTN4_LED1
  Bottom 0.254: IC1.3 27.43,41.78 27.81,42.16 30.23,42.16 32.26,44.2 32.26,65.02 33.15,65.91 38.02,65.91 BTN4.LED1+
BTN4_LED2
  Bottom 0.254: IC1.4 28.7,41.4 28.96,41.66 30.48,41.66 32.77,43.94 32.77,57.78 33.66,58.67 38.06,58.67 BTN4.LED2+
BTN5
  Bottom 0.254: IC5.13 19.94,51.94 R35.1 22.52,52.7 C23.2 22.61,50.97 BTN5.SW4 BTN5.SW3
BTN5_LED1  (via drill 0.6)
  Top 0.254: v17.91,69.85 17.91,59.35 BTN5.LED1+
  Bottom 0.254: v17.91,69.85 19.05,70.99 19.05,78.23 17.4,79.88 17.4,85.22 19.81,87.63 19.81,88.52 20.32,89.03 IC2.5
BTN5_LED2  (via drill 0.6)
  Top 0.254: v24.64,84.96 22.48,82.8 22.48,80.52 20.57,78.61 20.57,59.31 26.54,53.34 26.54,45.8 BTN5.LED2+
  Bottom 0.254: IC2.15 24.89,85.22 v24.64,84.96
BTN6  (via drill 0.6)
  Top 0.254: BTN6.SW4 32.73,50.51 32.26,50.04 32.26,45.21 28.45,41.4 17.4,41.4 13.72,45.09 13.72,49.91 v13.59,50.04
  Bottom 0.254: R33.1 10.29,50.67 IC5.3 12.95,50.67 v13.59,50.04 | BTN6.SW3 39.75,50.51 C24.2 35.11,50.25 BTN6.SW4
BTN6_LED1
  Bottom 0.254: BTN6.LED1+ 33.7,51.86 33.27,51.44 33.27,43.69 29.97,40.39 IC1.5
BTN6_LED2
  Bottom 0.254: IC1.6 31.24,40.89 34.16,43.81 37.26,43.81 BTN6.LED2+
CAN_H  (via drill 0.6)
  Top 0.61: BUS1.P$3 2.54,13.46 9.78,6.22 9.91,6.22 v17.14,6.22 29.46,6.22 31.24,8 43.05,8 43.31,8 43.94,8.64 43.94,10.79 BUS2.P$3
  Bottom 0.254: TERM.3 20.32,8.13 21.46,6.99 21.46,4.19 21.21,3.94 D2.7
  Bottom 0.635: D2.7 19.43,3.94 v17.14,6.22
CAN_L  (via drill 0.6)
  Top 0.61: BUS1.P$2 8.76,5.21 9.65,5.21 v16.13,5.21 29.84,5.21 31.75,7.11 43.56,7.11 44.32,7.11 45.21,8 45.21,9.53 BUS2.P$2
  Bottom 0.254: TERM.1 21.97,7.49 21.97,3.05 21.59,2.67 D2.6
  Bottom 0.635: D2.6 18.67,2.67 v16.13,5.21
CAN_RX
  Bottom 0.254: D2.4 27.05,1.4 R14.1
CAN_TX
  Bottom 0.254: D2.1 27.05,5.21 R13.1
CAN_VREF
  Bottom 0.254: R3.2 C16.2 R7.1 20.02,1.56 D2.5
DIN_1
  Bottom 0.254: C29.1 R43.1 3.81,182.75 4.06,182.5 7.87,182.5 8.76,181.61 IC4.11
DIN_2
  Bottom 0.254: C30.1 R44.1 19.52,187.96 17.02,187.96 16.13,188.85 13.59,188.85 13.21,188.47 13.21,183.51 12.57,182.88 IC4.12
DIN_3
  Bottom 0.254: ROT2.S2 15.2,203.41 R4.1 13.97,202.18 13.97,189.61 13.72,189.36 13.21,189.36 12.7,188.85 12.7,184.53 12.32,184.15 IC4.13
DIN_4
  Bottom 0.254: IC4.14 9.53,185.42 8,183.9 R5.1
DIN_5
  Bottom 0.254: ROT1.S2 40.51,205.03 R6.1 40.51,200.79 31.5,191.77 31.5,186.06 30.86,185.42 IC4.3
DIN_6
  Bottom 0.254: R39.1 C27.1 33.19,184.15 IC4.4
DIN_7
  Bottom 0.254: R40.1 C28.1 42.29,184.87 42.29,184.28 40.89,182.88 IC4.5
DIN_8
  Bottom 0.254: IC4.6 17.65,181.61 R9.1
DIN_15
  Bottom 0.254: IC5.5 10.03,53.21 R31.1
DIN_16
  Bottom 0.254: IC5.6 10.41,54.48 R30.1
FADER  (via drill 0.6)
  Top 0.254: v25.4,24.89 16.76,24.89 14.48,22.61 v14.48,18.16
  Bottom 0.254: CPU1.14 27.22,19.64 26.29,20.57 26.29,24 v25.4,24.89 | v14.48,18.16 14.48,7.73 FADER1.P2
GND
  pour Bottom: -6.86,241.3 -6.86,-0.89 49.91,-1.14 54.99,8.89 54.86,242.7
LCD_CLK  (via drill 0.6)
  Top 0.254: LCD.CLK 23.58,237.66 26.29,234.95 42.8,234.95 48.13,229.62 48.13,133.73 38.48,124.08 38.48,118.49 39.75,117.22 42.16,117.22 48.26,111.12 48.26,22.23 44.07,18.03 v35.94,18.03
  Bottom 0.254: CPU1.55 35.04,17.13 v35.94,18.03
LCD_CS  (via drill 0.6)
  Top 0.254: LCD.CS 43.31,237.66 50.29,230.68 50.29,132.97 40.51,123.19 40.51,120.4 41.4,119.51 43.31,119.51 50.29,112.52 50.29,21.21 44.07,14.99 33.78,14.99 33.53,14.73 v33.53,14.22
  Bottom 0.254: CPU1.58 v33.54,14.21 v33.53,14.22
LCD_DC  (via drill 0.6)
  Top 0.254: LCD.DC 31.45,237.66 32.51,236.6 43.69,236.6 49.78,230.5 49.78,133.1 40.01,123.32 40.01,119.89 41.02,118.87 43.18,118.87 49.78,112.27 49.78,21.46 43.81,15.49 v33.02,15.49
  Bottom 0.254: CPU1.59 33.04,13.31 32.77,13.59 32.77,15.24 v33.02,15.49
LCD_MOSI  (via drill 0.6)
  Top 0.254: LCD.MOSI 26.37,237.66 28.45,235.59 43.05,235.59 48.64,230 48.64,133.48 38.99,123.83 38.99,118.87 40.13,117.73 42.55,117.73 48.77,111.51 48.77,21.97 43.94,17.14 34.29,17.14 34.16,17.02 v34.16,16.51
  Bottom 0.254: CPU1.57 34.04,13.47 34.29,13.72 34.29,16.38 v34.16,16.51
LCD_RST  (via drill 0.6)
  Top 0.254: LCD.RES 29.04,237.66 30.61,236.09 43.43,236.09 49.28,230.25 49.28,133.35 39.5,123.57 39.5,119.63 40.89,118.24 42.8,118.24 49.28,111.76 49.28,21.72 43.81,16.26 v35.94,16.26
  Bottom 0.254: CPU1.54 35.54,15.86 v35.94,16.26
N$1
  Bottom 0.254: CPU1.6 26.26,15.64 U$19.P$1 21.56,17.89 C6.2
N$2
  Bottom 0.254: CPU1.5 25.8,15.14 U$19.P$2 21.44,13.35 C5.2
N$3
  Bottom 0.254: CPU1.47 41.67,13.64 C13.1
N$4
  Bottom 0.254: CPU1.31 37.54,23.99 C7.1
N$5
  Bottom 0.254: PWR.A R17.1
N$6
  Bottom 0.254: CPU1.60 32.54,7.85 R12.1
N$7
  Bottom 0.254: IC3.2 19.43,99.44 D1.5
N$8
  Bottom 0.254: D1.2 17.65,88.9 20.32,91.57 IC2.7
N$9
  Bottom 0.254: R18.1 41.61,62.32 BTN4.LED1-
N$10
  Bottom 0.254: BTN4.LED2- 36.54,62.23 R19.1
N$11
  Bottom 0.254: D1.1 17.91,86.36 19.3,87.76 19.3,89.28 20.32,90.3 IC2.6
N$12  (via drill 0.6)
  Top 0.254: v28.07,32.51 44.7,32.51 45.21,33.02 45.21,86.36 44.45,87.12 34.54,87.12 v34.29,87.38
  Bottom 0.254: IC1.14 27.43,33.15 v28.07,32.51 | v34.29,87.38 28.83,92.84 IC2.9
N$13
  Bottom 0.254: CPU1.62 31.54,5.89 R13.2
N$14
  Bottom 0.254: D1.20 7.62,86.36 RN1.2
N$15
  Bottom 0.254: D1.19 7.62,88.9 RN1.3
N$16
  Bottom 0.254: D1.18 7.62,91.44 RN1.4
N$17
  Bottom 0.254: D1.17 7.62,93.98 RN1.5
N$18
  Bottom 0.254: D1.16 7.62,96.52 RN1.6
N$19
  Bottom 0.254: RN2.2 7.62,100.33 D1.15
N$20
  Bottom 0.254: RN2.3 7.62,102.87 D1.14
N$21
  Bottom 0.254: RN2.4 7.62,105.41 D1.13
N$22
  Bottom 0.254: RN2.5 7.62,107.95 D1.12
N$23
  Bottom 0.254: RN2.6 7.62,110.49 D1.11
N$24
  Bottom 0.254: R20.1 29.93,75.27 BTN1.LED1-
N$25
  Bottom 0.254: BTN1.LED2- 22.73,76.2 23.62,75.31 23.62,71.41 R21.1
N$26
  Bottom 0.254: IC4.10 8.26,180.34 R38.1
N$27
  Bottom 0.254: CPU1.61 32.04,4.1 30.48,2.54 R14.2
N$28  (via drill 0.6)
  Top 0.254: v14.22,55.75 3.68,55.75 2.54,56.9 2.54,110.36 3.3,111.12 3.3,112.9 8.26,117.86 9.53,117.86 11.94,120.27 11.94,123.57 9.14,126.36 3.17,126.36 2.03,127.51 2.03,136.78 2.67,137.41 2.67,139.19 1.52,140.34 1.52,160.91 2.29,161.67 2.29,163.83 1.02,165.1 1.02,176.02 v1.65,176.66
  Bottom 0.254: R1.1 IC4.9 8,179.07 7.87,178.94 7.87,177.93 6.73,176.78 1.78,176.78 v1.65,176.66 | v14.22,55.75 IC5.10
N$29
  Bottom 0.254: R24.1 29.59,51.69 30.23,51.05 30.23,49.49 BTN5.LED1-
N$30
  Bottom 0.254: R25.1 22.65,47.41 BTN5.LED2-
N$31
  Bottom 0.254: R2.1 LED.A
N$32
  Bottom 0.254: ROT1.B 40.6,188.64 R42.2 R40.2
N$33
  Bottom 0.254: ROT1.A 35.6,188.8 R41.2 R39.2
N$34
  Bottom 0.254: BTN6.LED1- 41.49,48.26 R26.1
N$35
  Bottom 0.254: R27.1 35.35,47.41 BTN6.LED2-
N$36
  Bottom 0.254: ROT2.B 18.38,190.62 R46.2 R44.2
N$37
  Bottom 0.254: R43.2 R45.2 9.66,190.08 ROT2.A
N$38
  Bottom 0.254: IC3.7 19.94,105.79 D1.10
N$39
  Bottom 0.254: BTN2.LED1- 39.28,76.2 R22.1
N$40
  Bottom 0.254: BTN2.LED2- 36.66,76.2 R23.1
N$41
  Bottom 0.254: IC3.6 18.67,104.52 D1.9
N$42
  Bottom 0.254: IC3.5 17.4,103.25 D1.8
N$43
  Bottom 0.254: CPU1.25 34.54,27.81 36.2,29.46 38.7,29.46 R2.2
N$44
  Bottom 0.254: R28.1 29.21,57.91 29.97,58.67 29.97,61.26 BTN3.LED1-
N$45
  Bottom 0.254: R29.1 BTN3.LED2-
N$46  (via drill 0.6)
  Top 0.254: v16.51,8 16.51,8.64 17.14,9.27 21.21,9.27 TERM.2
  Bottom 0.254: R7.2 16.13,3.81 15.24,4.7 15.24,5.46 16.51,6.73 v16.51,8
N$47  (via drill 0.6)
  Top 0.254: v16.13,9.78 19.18,9.78 TERM.4
  Bottom 0.254: R3.1 12.57,3.43 15.75,6.6 15.75,9.4 v16.13,9.78
N$52
  Bottom 0.254: IC3.4 16.89,101.98 D1.7
N$53
  Bottom 0.254: IC3.3 18.16,100.71 D1.6
N$55
  Bottom 0.254: IC3.1 20.7,98.17 D1.4
N$56
  Bottom 0.254: D1.3 24.51,99.44 IC3.15
N$57  (via drill 0.6)
  Top 0.254: v22.86,106.68 22.86,89.66 23.5,89.03 23.5,86.87 v23.88,86.49
  Bottom 0.254: IC3.9 23.24,107.06 v22.86,106.68 | v23.88,86.49 IC2.14
N$73
  Bottom 0.254: D2.8 20.19,5.34 R10.1
NRST  (via drill 0.6)
  Top 0.254: v30.99,15.62 30.99,12.06 v33.91,9.14
  Bottom 0.254: 34.16,8.89 v33.91,9.14 34.92,8.13 TC1.10 | 28.53,16.13 CPU1.7 30.47,16.14 v30.99,15.62
PB2  (via drill 0.6)
  Top 0.254: v36.45,21.08 v41.4,21.08
  Bottom 0.254: CPU1.28 36.04,21.49 v36.45,21.08 | v41.4,21.08 41.53,21.08 42.16,21.72 42.16,23.05 | 42.16,23.05 USR.B | 42.16,23.05 48.51,23.05 USR.B'
POT1  (via drill 0.6)
  Top 0.254: v19.68,27.81 7.24,27.81 0.51,34.54 0.51,112.39 7.49,119.38 9.14,119.38 10.41,120.65 10.41,122.94 8.51,124.84 2.54,124.84 0.51,126.87 0.51,162.18 v1.02,162.69
  Bottom 0.254: CPU1.15 27.61,20.14 26.92,20.83 26.92,25.27 24.38,27.81 v19.68,27.81 | v1.02,162.69 9.67,162.69 POT1.CENTER
POT2  (via drill 0.6)
  Top 0.254: v34.92,29.46 45.09,29.46 47.24,31.62 47.24,99.44 46.35,100.33 46.35,101.73 47.75,103.12 47.75,111 42.16,116.59 39.62,116.59 37.97,118.24 37.97,124.46 47.5,133.99 47.5,163.58 46.61,164.47 39.35,164.47 POT2.CENTER
  Bottom 0.254: CPU1.23 33.54,28.08 v34.92,29.46
POT3  (via drill 0.6)
  Top 0.254: v18.54,28.57 7.24,28.57 1.02,34.8 1.02,112.27 7.62,118.87 9.27,118.87 10.92,120.52 10.92,123.19 8.76,125.35 2.67,125.35 1.02,127 1.02,138.18 v1.27,138.43
  Bottom 0.254: CPU1.16 28.13,20.64 27.43,21.34 27.43,25.78 24.64,28.57 v18.54,28.57 | v1.27,138.43 10.81,138.43 POT3.CENTER
POT4  (via drill 0.6)
  Top 0.254: 38.12,140.32 POT4.CENTER 37.47,139.69 37.47,118.11 39.5,116.08 41.78,116.08 47.24,110.62 47.24,103.38 45.85,101.98 45.85,100.08 46.74,99.19 46.74,31.75 45.21,30.23 v35.94,30.23
  Bottom 0.254: CPU1.22 33.04,28.85 34.42,30.23 v35.94,30.23
POT5  (via drill 0.6)
  Top 0.254: v27.18,29.34 v24.38,29.34 | v17.4,29.34 7.24,29.34 1.52,35.05 1.52,111.38 v2.03,111.89
  Bottom 0.254: CPU1.17 29.81,22.64 28.19,24.26 28.19,28.7 27.56,29.34 v27.18,29.34 | v24.38,29.34 v17.4,29.34 | v2.03,111.89 3.3,113.16 11.81,113.16 12.7,114.05 POT5.CENTER
POT6  (via drill 0.6)
  Top 0.254: v37.85,31.75 45.09,31.75 45.72,32.38 45.72,86.61 44.96,87.38 44.96,88.52 46.23,89.79 46.23,98.93 45.34,99.82 45.34,102.23 46.74,103.63 46.74,110.24 43.43,113.54 39.48,113.54 POT6.CENTER
  Bottom 0.254: CPU1.20 32.04,29.75 34.04,31.75 v37.85,31.75
POT7  (via drill 0.6)
  Top 0.254: v36.96,30.99 45.21,30.99 46.23,32 46.23,87.38 v45.72,87.88
  Bottom 0.254: CPU1.21 32.54,29.36 34.16,30.99 v36.96,30.99 | v45.72,87.88 39.74,87.88 POT7.CENTER
SPI2_CLK  (via drill 0.6)
  Top 0.254: v23.88,90.68 23.88,103.89 v24.51,104.52 24.51,104.9 23.88,105.54 v23.88,108.71 | v14.22,186.69 2.67,186.69 1.02,185.04 1.02,178.56 2.54,177.04 2.54,176.15 1.52,175.13 1.52,165.35 2.79,164.08 2.79,161.29 2.16,160.66 2.16,140.46 3.17,139.45 3.17,137.29 2.54,136.65 2.54,127.89 2.67,127.76 3.43,127 9.27,127 12.45,123.83 12.45,121.41 v19.3,114.55 | v29.08,86.87 28.07,85.85 24.38,85.85 23.75,85.22 19.68,85.22 14.61,80.14 14.61,75.82 15.88,74.55 v15.88,49.4 15.88,45.72 17.65,43.94 19.68,43.94 v20.57,43.05 | v33.66,20.83 32,20.83 31.24,21.59 v31.24,31.11
  Bottom 0.254: v23.88,90.68 24.26,90.3 IC2.11 28.32,90.3 29.08,89.53 v29.08,86.87 | v24.51,104.52 IC3.11 26.68,104.39 | IC4.2 v14.22,186.69 | IC5.2 12.57,49.4 13.21,48.77 15.24,48.77 v15.88,49.4 | v20.57,43.05 20.57,40.89 25.02,36.45 30.48,36.45 31.24,35.69 IC1.11 v31.24,31.11 | CPU1.34 35.99,20.14 35.31,20.83 v33.66,20.83 | v23.88,108.71 23.88,109.98 v19.3,114.55
SPI2_MISO  (via drill 0.6)
  Top 0.254: v18.8,56.39 18.8,45.97 v21.84,42.93 | v25.4,37.34 25.4,30.99 25.91,30.48 v28.19,30.48 | v35.05,19.81 31.88,19.81 29.08,22.61 v29.08,28.45
  Bottom 0.254: IC5.9 18.16,57.02 v18.8,56.39 | v21.84,42.93 21.84,40.89 v25.4,37.34 | CPU1.35 35.22,19.64 v35.05,19.81 | v29.08,28.45 29.08,29.59 v28.19,30.48
SPI2_MOSI  (via drill 0.6)
  Top 0.254: v41.66,19.18 44.32,19.18 47.75,22.61 47.75,100.2 v47.12,100.84
  Bottom 0.254: CPU1.36 41.62,19.14 v41.66,19.18 | v47.12,100.84 26.68,100.84 IC3.14
SPI2_RC1  (via drill 0.6)
  Top 0.254: v24.77,102.87 24.77,89.79 v25.15,89.41 | v22.48,86.49 21.84,85.85 19.56,85.85 14.1,80.39 14.1,75.31 15.11,74.3 15.11,45.21 17.27,43.05 v18.16,43.05 | v29.97,30.35 29.34,29.72 28.83,29.72 27.18,28.07 v27.18,18.29
  Bottom 0.254: IC3.12 25.15,103.25 v24.77,102.87 | v25.15,89.41 25.53,89.03 IC2.12 25.02,89.03 v22.48,86.49 | v29.97,30.35 IC1.12 29.97,34.8 28.83,35.94 24.89,35.94 20.07,40.77 20.07,42.16 19.18,43.05 v18.16,43.05 | CPU1.11 27.32,18.14 v27.18,18.29
SPI2_RC2  (via drill 0.6)
  Top 0.254: v26.16,17.65 26.16,26.04 v13.46,38.73 | v13.97,187.96 3.17,187.96 0.51,185.29 0.51,164.85 1.78,163.58 1.78,161.93 1.02,161.16 1.02,140.08 2.16,138.94 2.16,137.67 1.52,137.03 1.52,127.25 2.92,125.86 9.02,125.86 11.43,123.44 11.43,120.4 9.4,118.36 7.87,118.36 2.79,113.28 2.79,111.38 2.03,110.62 2.03,49.91 v3.68,48.26
  Bottom 0.254: CPU1.10 27.93,17.64 27.69,17.4 26.42,17.4 v26.16,17.65 | IC5.1 | IC4.1 v13.97,187.96 | v13.46,38.73 13.46,47.62 12.95,48.13 IC5.1 | IC5.1 3.81,48.13 v3.68,48.26
SWCK
  Bottom 0.254: CPU1.49 38.04,3.87 TC1.4
SWDIO
  Bottom 0.254: TC1.2 39.12,4.06 39.12,13.97 39.29,14.14 CPU1.46
UART_RX
  Bottom 0.254: CPU1.52 36.54,3.52 TC1.8
UART_TX
  Bottom 0.254: CPU1.51 37.04,3.6 TC1.6

### Text on the board
tNames: midimixer-channel rev A | Eran Rundstein, 2017
bNames: GND | GND | H | H | L | L | 5V | 5V